# Altium project _X-Link-v11.PrjPCB
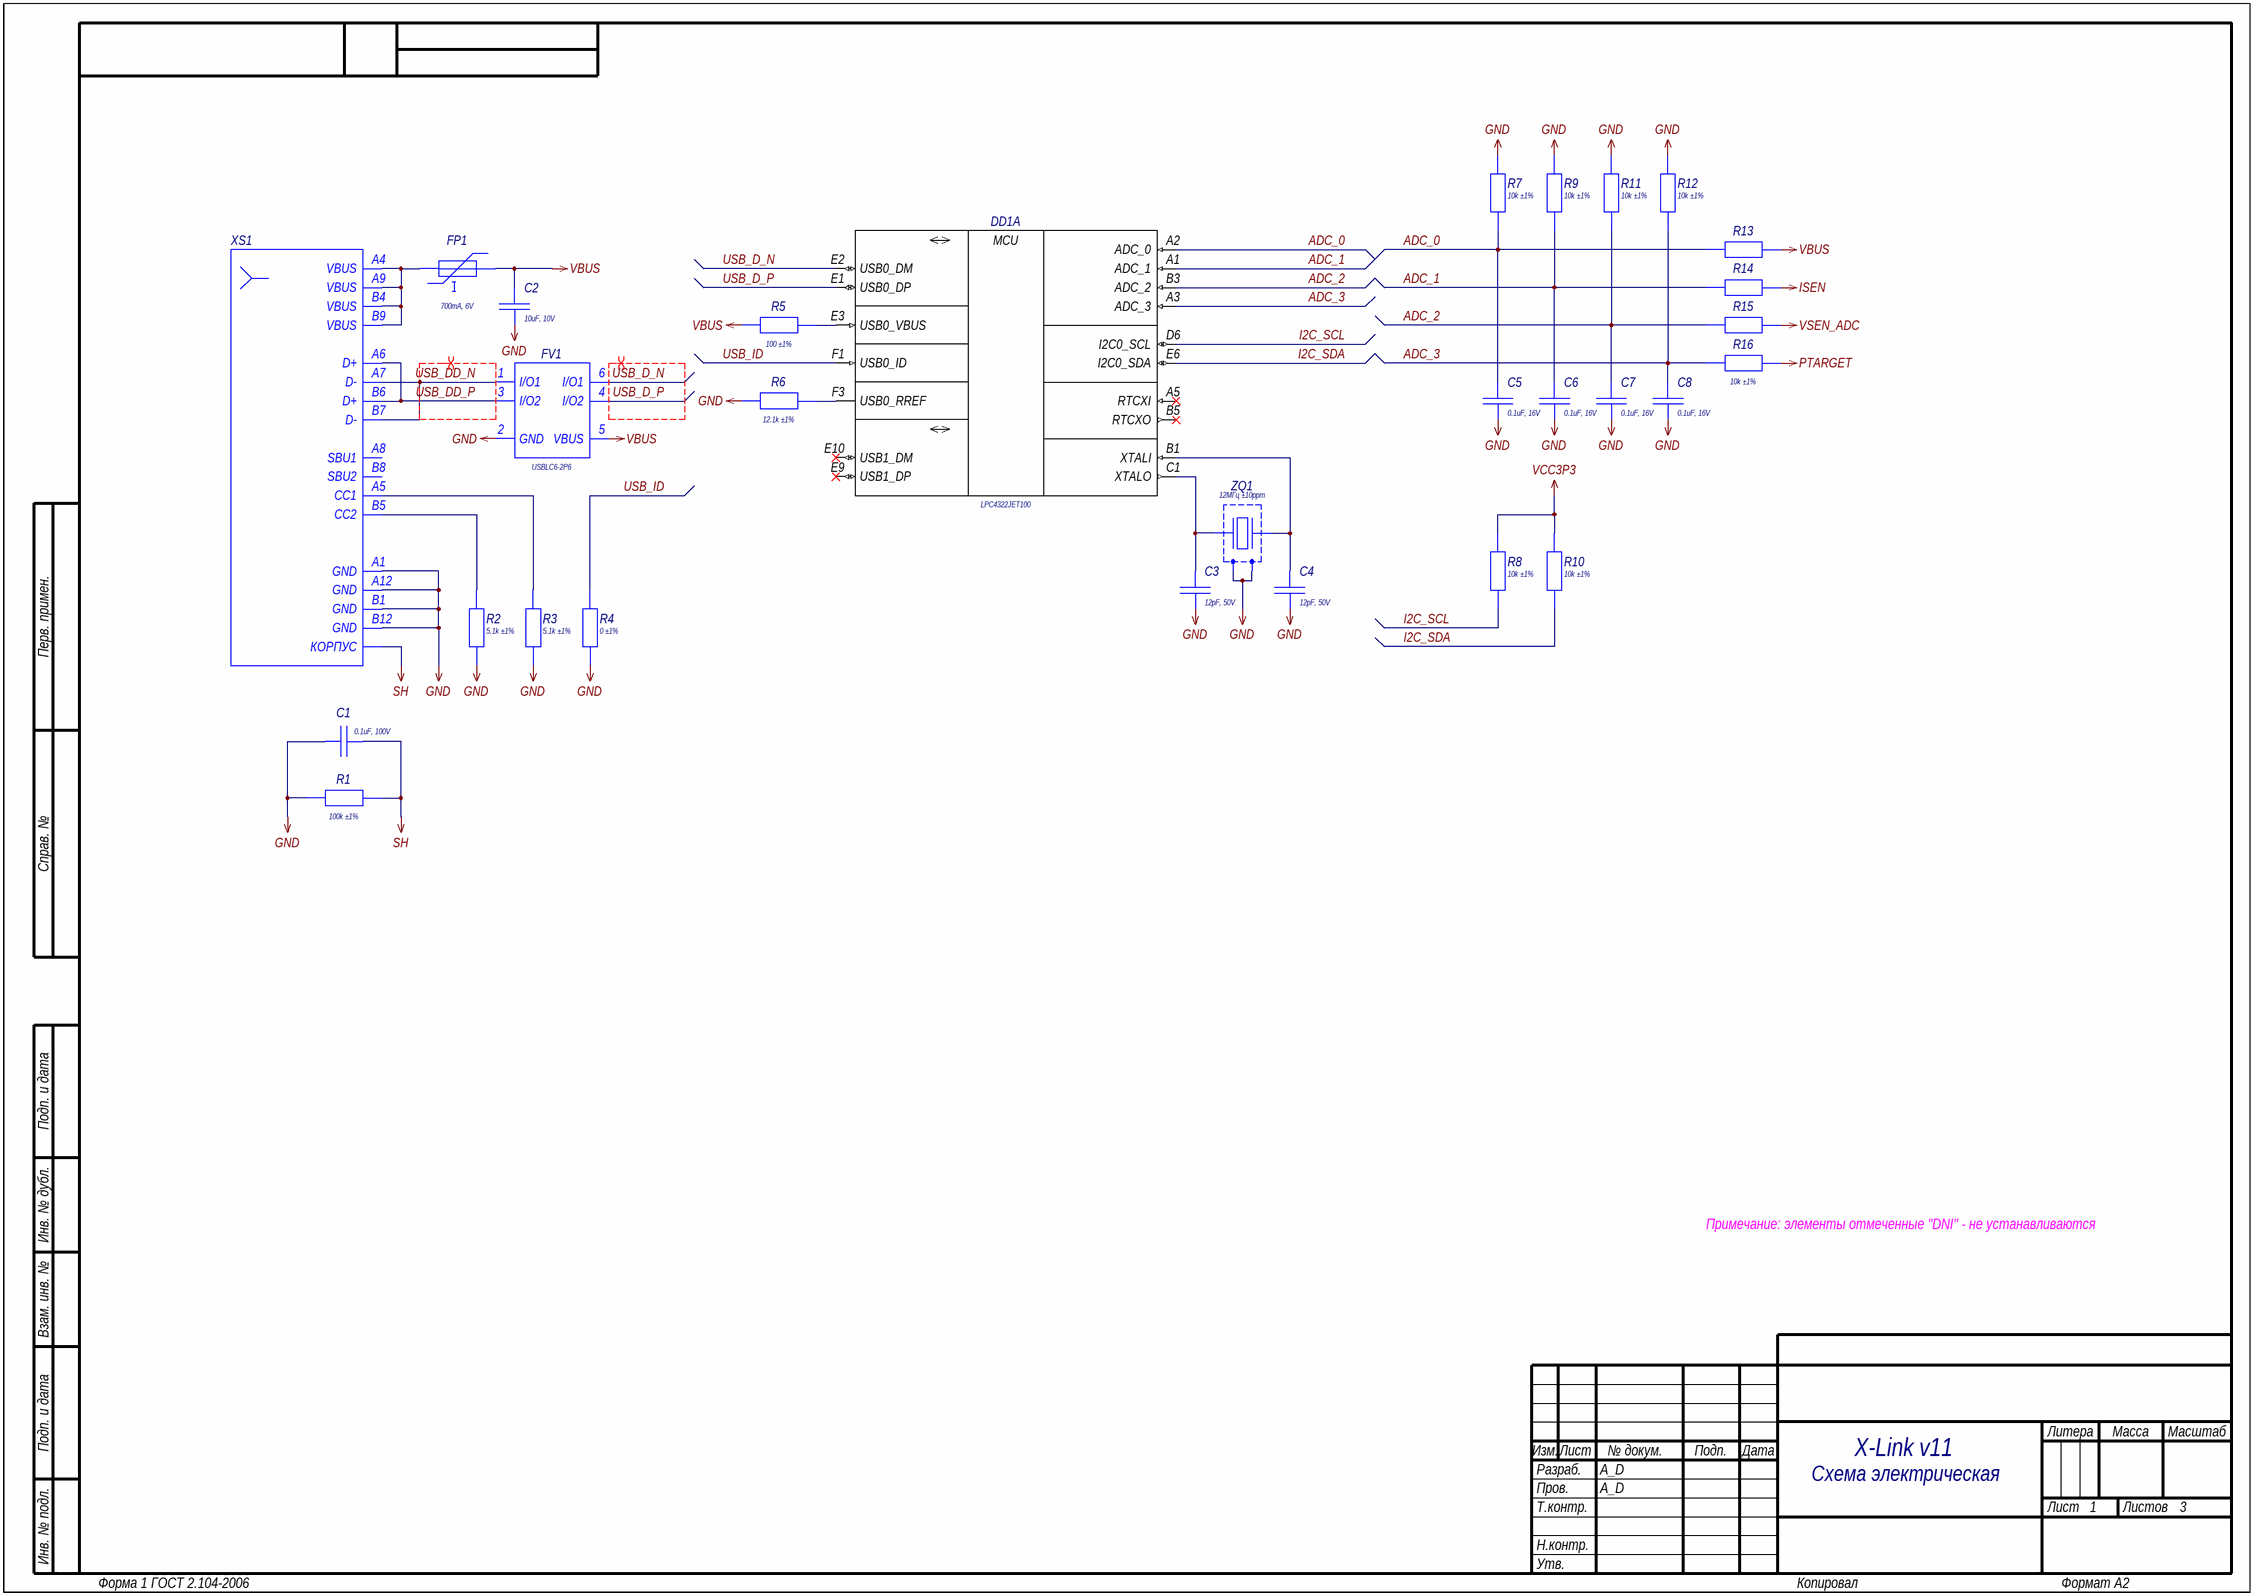
[diagram p0: 01_USB.SchDoc]
PCB_Week: 2347; GlobalProjectRevision: 1.1; GlobalProjectNumber: X-Link v11; GlobalProjectName: X-Link v11
3 sheets, 138 parts. Net scope: global (net labels, ports and power ports of the same name join across sheets).
Board file: PCB.PcbDoc
Sheets:
  01_USB.SchDoc
  02_MCU_IO.SchDoc
  03_POWER.SchDoc

## Sheet 01_USB.SchDoc: =GlobalProjectName
size 594 x 420 mm; CheckedBy: A_D; Author: A_D; DocumentNumber: X-Link v11 Э3; Revision: 1.1; SheetNumber: 1; SheetTotal: 3; PageSetup: Record=PageOptions|CenterHorizontal=True|CenterVertical=True|PrintScale=0.70|XCorrection=1.00|YCorrection=1.00|PrintKind=2|BorderSize=5000000|LeftOffset=9000|BottomOffset=10100|Orientation=2|PaperLength=11176|PaperWidth=8636|Scale=100|PaperSource=259|PrintQuality=-3|MediaType=1|DitherType=10|PrintScaleMode=1|PaperKind=A3|PaperIndex=8; FirstApplication: X-Link v11; DocumentName: X-Link v11

### Parts
C1  Schematic Value: 0.1uF, 100V  [C0603_160X080H080_H]  (hidden comment: Capacitor)
C2  Schematic Value: 10uF, 10V  [C0603_160X080H080_H]  (hidden comment: Capacitor)
C3  Schematic Value: 12pF, 50V  [C0402_100X050H050_H]  (hidden comment: Capacitor)
C4  Schematic Value: 12pF, 50V  [C0402_100X050H050_H]  (hidden comment: Capacitor)
C5  Schematic Value: 0.1uF, 16V  [C0402_100X050H050_H]  (hidden comment: Capacitor)
C6  Schematic Value: 0.1uF, 16V  [C0402_100X050H050_H]  (hidden comment: Capacitor)
C7  Schematic Value: 0.1uF, 16V  [C0402_100X050H050_H]  (hidden comment: Capacitor)
C8  Schematic Value: 0.1uF, 16V  [C0402_100X050H050_H]  (hidden comment: Capacitor)
DD1  Schematic Value: LPC4322JET100  [TFBGA-100_080P900X900X120_N]  (hidden comment: LPC43xxJET100-Series)  (part A of 3)
FP1  Schematic Value: 700mA, 6V  [F0402_115X065H060_H]  (hidden comment: Fuse_PTC)
FV1  Schematic Value: USBLC6-2P6  [SOT-666_050P160X120X060_N]  (hidden comment: USBLC6-2x6)
R1  Schematic Value: 100k ±1%  [R0402_100X050H035_H]  (hidden comment: Resistor)
R2  Schematic Value: 5.1k ±1%  [R0402_100X050H035_H]  (hidden comment: Resistor)
R3  Schematic Value: 5.1k ±1%  [R0402_100X050H035_H]  (hidden comment: Resistor)
R4  Schematic Value: 0 ±1%  [R0402_100X050H035_H]  (hidden comment: Resistor)
R5  Schematic Value: 100 ±1%  [R0402_100X050H035_H]  (hidden comment: Resistor)
R6  Schematic Value: 12.1k ±1%  [R0402_100X050H035_H]  (hidden comment: Resistor)
R7  Schematic Value: 10k ±1%  [R0402_100X050H035_H]  (hidden comment: Resistor)
R8  Schematic Value: 10k ±1%  [R0402_100X050H035_H]  (hidden comment: Resistor)
R9  Schematic Value: 10k ±1%  [R0402_100X050H035_H]  (hidden comment: Resistor)
R10  Schematic Value: 10k ±1%  [R0402_100X050H035_H]  (hidden comment: Resistor)
R11  Schematic Value: 10k ±1%  [R0402_100X050H035_H]  (hidden comment: Resistor)
R12  Schematic Value: 10k ±1%  [R0402_100X050H035_H]  (hidden comment: Resistor)
R13  Resistor  [R0402_100X050H035_H]  (value not drawn)
R14  Resistor  [R0402_100X050H035_H]  (value not drawn)
R15  Resistor  [R0402_100X050H035_H]  (value not drawn)
R16  Schematic Value: 10k ±1%  [R0402_100X050H035_H]  (hidden comment: Resistor)
XS1  Text  [U262-161N-4BVC11]  (value not drawn)
ZQ1  Schematic Value: 12МГц ±10ppm  [SMD 3.2x2.5mm]  (hidden comment: Crystal-1_3p_S)

### Nets
GND: C1.2 C2.1 C3.1 C4.1 C5.1 C6.1 C7.1 C8.1 FV1.2(GND) R1.2 R2.1 R3.1 R4.1 R6.1 R7.1 R9.1 R11.1 R12.1 XS1.A1(GND) XS1.A12(GND) XS1.B1(GND) XS1.B12(GND) ZQ1.2 ZQ1.4
ISEN: R14.1
PTARGET: R16.1
SH: C1.1 R1.1 XS1.SH(КОРПУС)
VBUS: C2.2 FP1.2 FV1.5(VBUS) R5.1 R13.1
VCC3P3: R8.1 R10.1
VSEN_ADC: R15.1
ADC_0: C5.2 DD1.A2(ADC_0) R7.2 R13.2
ADC_1: C6.2 DD1.A1(ADC_1) R9.2 R14.2
ADC_2: C7.2 DD1.B3(ADC_2) R11.2 R15.2
ADC_3: C8.2 DD1.A3(ADC_3) R12.2 R16.2
I2C_SCL: DD1.D6(I2C0_SCL) R8.2
I2C_SDA: DD1.E6(I2C0_SDA) R10.2
USB_D_N: DD1.E2(USB0_DM) FV1.6(I/O1)
USB_D_P: DD1.E1(USB0_DP) FV1.4(I/O2)
USB_DD_N: FV1.1(I/O1) XS1.A7(D-) XS1.B7(D-)
USB_DD_P: FV1.3(I/O2) XS1.A6(D+) XS1.B6(D+)
USB_ID: DD1.F1(USB0_ID) R4.2
NetC3_2: C3.2 DD1.C1(XTALO) ZQ1.1
NetC4_2: C4.2 DD1.B1(XTALI) ZQ1.3
NetDD1_E3: DD1.E3(USB0_VBUS) R5.2
NetDD1_F3: DD1.F3(USB0_RREF) R6.2
NetFP1_1: FP1.1 XS1.A4(VBUS) XS1.A9(VBUS) XS1.B4(VBUS) XS1.B9(VBUS)
NetR2_2: R2.2 XS1.B5(CC2)
NetR3_2: R3.2 XS1.A5(CC1)

Not connected (* = marked no-connect by the designer): DD1 A5(RTCXI)* B5(RTCXO)* E9(USB1_DP)* E10(USB1_DM)*; XS1 A8(SBU1) B8(SBU2)

### Layout directives
differential pair: USB_D_N, USB_D_P, USB_DD_N, USB_DD_P

### Notes on the sheet
- Примечание: элементы отмеченные "DNI" - не устанавливаются
- Схема электрическая
  принципиальная
- Перв. примен.
- Справ. №
- Подп. и дата
- Инв. № дубл.
- Взам. инв. №
- Разраб.
- Изм.
- Лист
- № докум.
- Подп.
- Дата
- Литера
- Масса
- Масштаб
- Пров.
- Т.контр.
- Листов
- Инв. № подл.
- Н.контр.
- Утв.
- Форма 1 ГОСТ 2.104-2006
- Копировал
- Формат А2
- (in symbol LPC4322JET100, part A) MCU

### Library data of the parts
C1 = GRM188R72A104KA35D: Manufacturer: Murata; ID: 232; Value: 0.1uF; Voltage: 100V; Tolerance: ±10%; Dielectric Type: X7R; Functional Analog: GRM188R72A104KA35J; AEC Standard: General; Part Number: GRM188R72A104KA35D; Footprint: 0603; LCSC Part: C113803; Temperature Min: -55°С; Temperature Max: +125°С; Part Type: Конденсатор; ClassName: DC
C2 = GRM188R61A106KE69D: Manufacturer: Murata; ID: 173; Value: 10uF; Voltage: 10V; Tolerance: ±10%; Dielectric Type: X5R; Functional Analog: GRM188R61A106KE69J; AEC Standard: General; Part Number: GRM188R61A106KE69D; Footprint: 0603; LCSC Part: C77044; Temperature Min: -55°С; Temperature Max: +85°С; Part Type: Конденсатор; ClassName: DC
C3 C4 = GRM1555C1H120JA01D: Manufacturer: Murata; ID: 159; Value: 12pF; Voltage: 50V; Tolerance: ±5%; Dielectric Type: NP0; Functional Analog: GJM1555C1H120GB01D, GRM1555C1H120JA01J, GRM1555C1H120JA01W; AEC Standard: General; Part Number: GRM1555C1H120JA01D; Footprint: 0402; LCSC Part: C76948; Temperature Min: -55°С; Temperature Max: +125°С; Part Type: Конденсатор
C5-C8 = GCM155R71C104KA55D: Manufacturer: Murata; ID: 163; Value: 0.1uF; Voltage: 16V; Tolerance: ±10%; Dielectric Type: X7R; Functional Analog: GRM155R71C104KA88D, GCM155R71C104KA55J, GCM155R71C104KA55W; AEC Standard: AEC-Q200; Part Number: GCM155R71C104KA55D; Footprint: 0402; LCSC Part: C85857; Temperature Min: -55°С; Temperature Max: +125°С; Part Type: Конденсатор
DD1 = LPC4322JET100: Manufacturer: NXP Semiconductors; ID: 45; Supply Operation: +2.4…3.6V; Prog Interface: JTAG, SWD, USB; Operation Frequency: 204MHz; ROM: 512K; RAM: 104K; IO Lines: 49; Part Number: LPC4322JET100; Value: LPC4322JET100; Temperature Min: -40°С; Temperature Max: +105°С
FP1 = 0402L035SLKR: Manufacturer: Littelfuse; ID: 17; Limit Voltage: 6V; Hold Current: 350mA; Resistance: 0.7ohm; Trip Current: 700mA; Current Rating Max: 50A; Part Number: 0402L035SLKR; Value: 0402L035SLKR; Temperature Min: -40°С; Temperature Max: +85°С; Part Type: Предохранитель; ClassName: DC
FV1 = USBLC6-2P6: Manufacturer: STMicroelectronics; ID: 30; Breakdown Voltage: 6V; Reverse Stand Off Voltage: 17V; Forward Voltage: 0.95V; Peak Forward Current: 5A; Junction Capacitance: 2.5pF; Directional: Bidirectional; Functional Analog: TPUSBLC6-2P6; Part Number: USBLC6-2P6; Value: USBLC6-2P6; LCSC Part: C15999; Temperature Min: -40°С; Temperature Max: +125°С
R1 = 0402WGF1003TCE: Manufacturer: Uniroyal Elec; ID: 661; Value: 100k; Limit Voltage: 50V; Tolerance: ±1%; Temperature Coefficient: 100ppm; Total Power Dissipation: 0.1W; Series Type: Thick-Film; Part Number: 0402WGF1003TCE; Footprint: 0402; Temperature Min: -55°С; Temperature Max: +155°С; Part Type: Резистор; LCSC Part: C25741; ClassName: DC
R2 R3 = 0402WGF5101TCE: Manufacturer: Uniroyal Elec; ID: 667; Value: 5.1k; Limit Voltage: 50V; Tolerance: ±1%; Temperature Coefficient: 100ppm; Total Power Dissipation: 0.1W; Series Type: Thick-Film; Part Number: 0402WGF5101TCE; Footprint: 0402; Temperature Min: -55°С; Temperature Max: +155°С; Part Type: Резистор; LCSC Part: C25905
R4 = 0402WGF0000TCE: Manufacturer: Uniroyal Elec; ID: 666; Value: 0; Limit Voltage: 50V; Tolerance: ±1%; Temperature Coefficient: 800ppm; Total Power Dissipation: 0.1W; Series Type: Thick-Film; Part Number: 0402WGF0000TCE; Footprint: 0402; Temperature Min: -55°С; Temperature Max: +155°С; Part Type: Резистор; LCSC Part: C17168
R5 = RC0402FR-07100RL: Manufacturer: Yageo; ID: 457; Value: 100; Limit Voltage: 50V; Tolerance: ±1%; Temperature Coefficient: 100ppm; Total Power Dissipation: 0.1W; Series Type: Thick-Film; Part Number: RC0402FR-07100RL; Footprint: 0402; Temperature Min: -55°С; Temperature Max: +155°С; Part Type: Резистор
R6 = RC0402FR-0712K1L: Manufacturer: Yageo; ID: 484; Value: 12.1k; Limit Voltage: 50V; Tolerance: ±1%; Temperature Coefficient: 100ppm; Total Power Dissipation: 0.1W; Series Type: Thick-Film; Part Number: RC0402FR-0712K1L; Footprint: 0402; Temperature Min: -55°С; Temperature Max: +155°С; Part Type: Резистор
R7-R12 R16 = 0402WGF1002TCE: Manufacturer: Uniroyal Elec; ID: 665; Value: 10k; Limit Voltage: 50V; Tolerance: ±1%; Temperature Coefficient: 100ppm; Total Power Dissipation: 0.1W; Series Type: Thick-Film; Part Number: 0402WGF1002TCE; Footprint: 0402; Temperature Min: -55°С; Temperature Max: +155°С; Part Type: Резистор; LCSC Part: C25744
R13-R15 = 0402WGF1002TCE: Manufacturer: Uniroyal Elec; ID: 665; Value: 10k; Limit Voltage: 50V; Tolerance: ±1%; Temperature Coefficient: 100ppm; Total Power Dissipation: 0.1W; Series Type: Thick-Film; Schematic Value: 10k ±1%; Part Number: 0402WGF1002TCE; Footprint: 0402; Temperature Min: -55°С; Temperature Max: +155°С; Part Type: Резистор; LCSC Part: C25744
XS1 = U262-161N-4BVC11: Manufacturer: XKB Enterprise; ID: 41; Limit Voltage: 30V; Limit Current: 3A; Connector Type: Female; Interface: USB 3.1 Type C; Max Data Rate: 5 Gbps; Part Number: U262-161N-4BVC11; Value: U262-161N-4BVC11; Pins: 16; Mount Type: Surface; LCSC Part: C319148; Temperature Min: -40°С; Temperature Max: +85°С; Schematic Value: U262-161N-4BVC11; Part Type: Розетка; ClassName: DC
ZQ1 = X322512MOB4SI: Manufacturer: Yangxing Tech; ID: 44; Output Frequency: 12МГц; Shunt Capacitance: 7pF; Load Capacitance: 12pF; Temperature Coefficient: ±10ppm; Part Number: X322512MOB4SI; Value: X322512MOB4SI; LCSC Part: C70565; Temperature Min: -40°С; Temperature Max: +85°С; Part Type: Кварцевый резонатор

## Sheet 02_MCU_IO.SchDoc: =GlobalProjectName
size 594 x 420 mm; CheckedBy: A_D; Author: A_D; DocumentNumber: X-Link v11 Э3; Revision: 1.1; SheetNumber: 2; SheetTotal: 3; PageSetup: Record=PageOptions|CenterHorizontal=True|CenterVertical=True|PrintScale=0.70|XCorrection=1.00|YCorrection=1.00|PrintKind=2|BorderSize=5000000|LeftOffset=9000|BottomOffset=10100|Orientation=2|PaperLength=11176|PaperWidth=8636|Scale=100|PaperSource=259|PrintQuality=-3|MediaType=1|DitherType=10|PrintScaleMode=1|PaperKind=A3|PaperIndex=8; FirstApplication: X-Link v11; DocumentName: X-Link v11
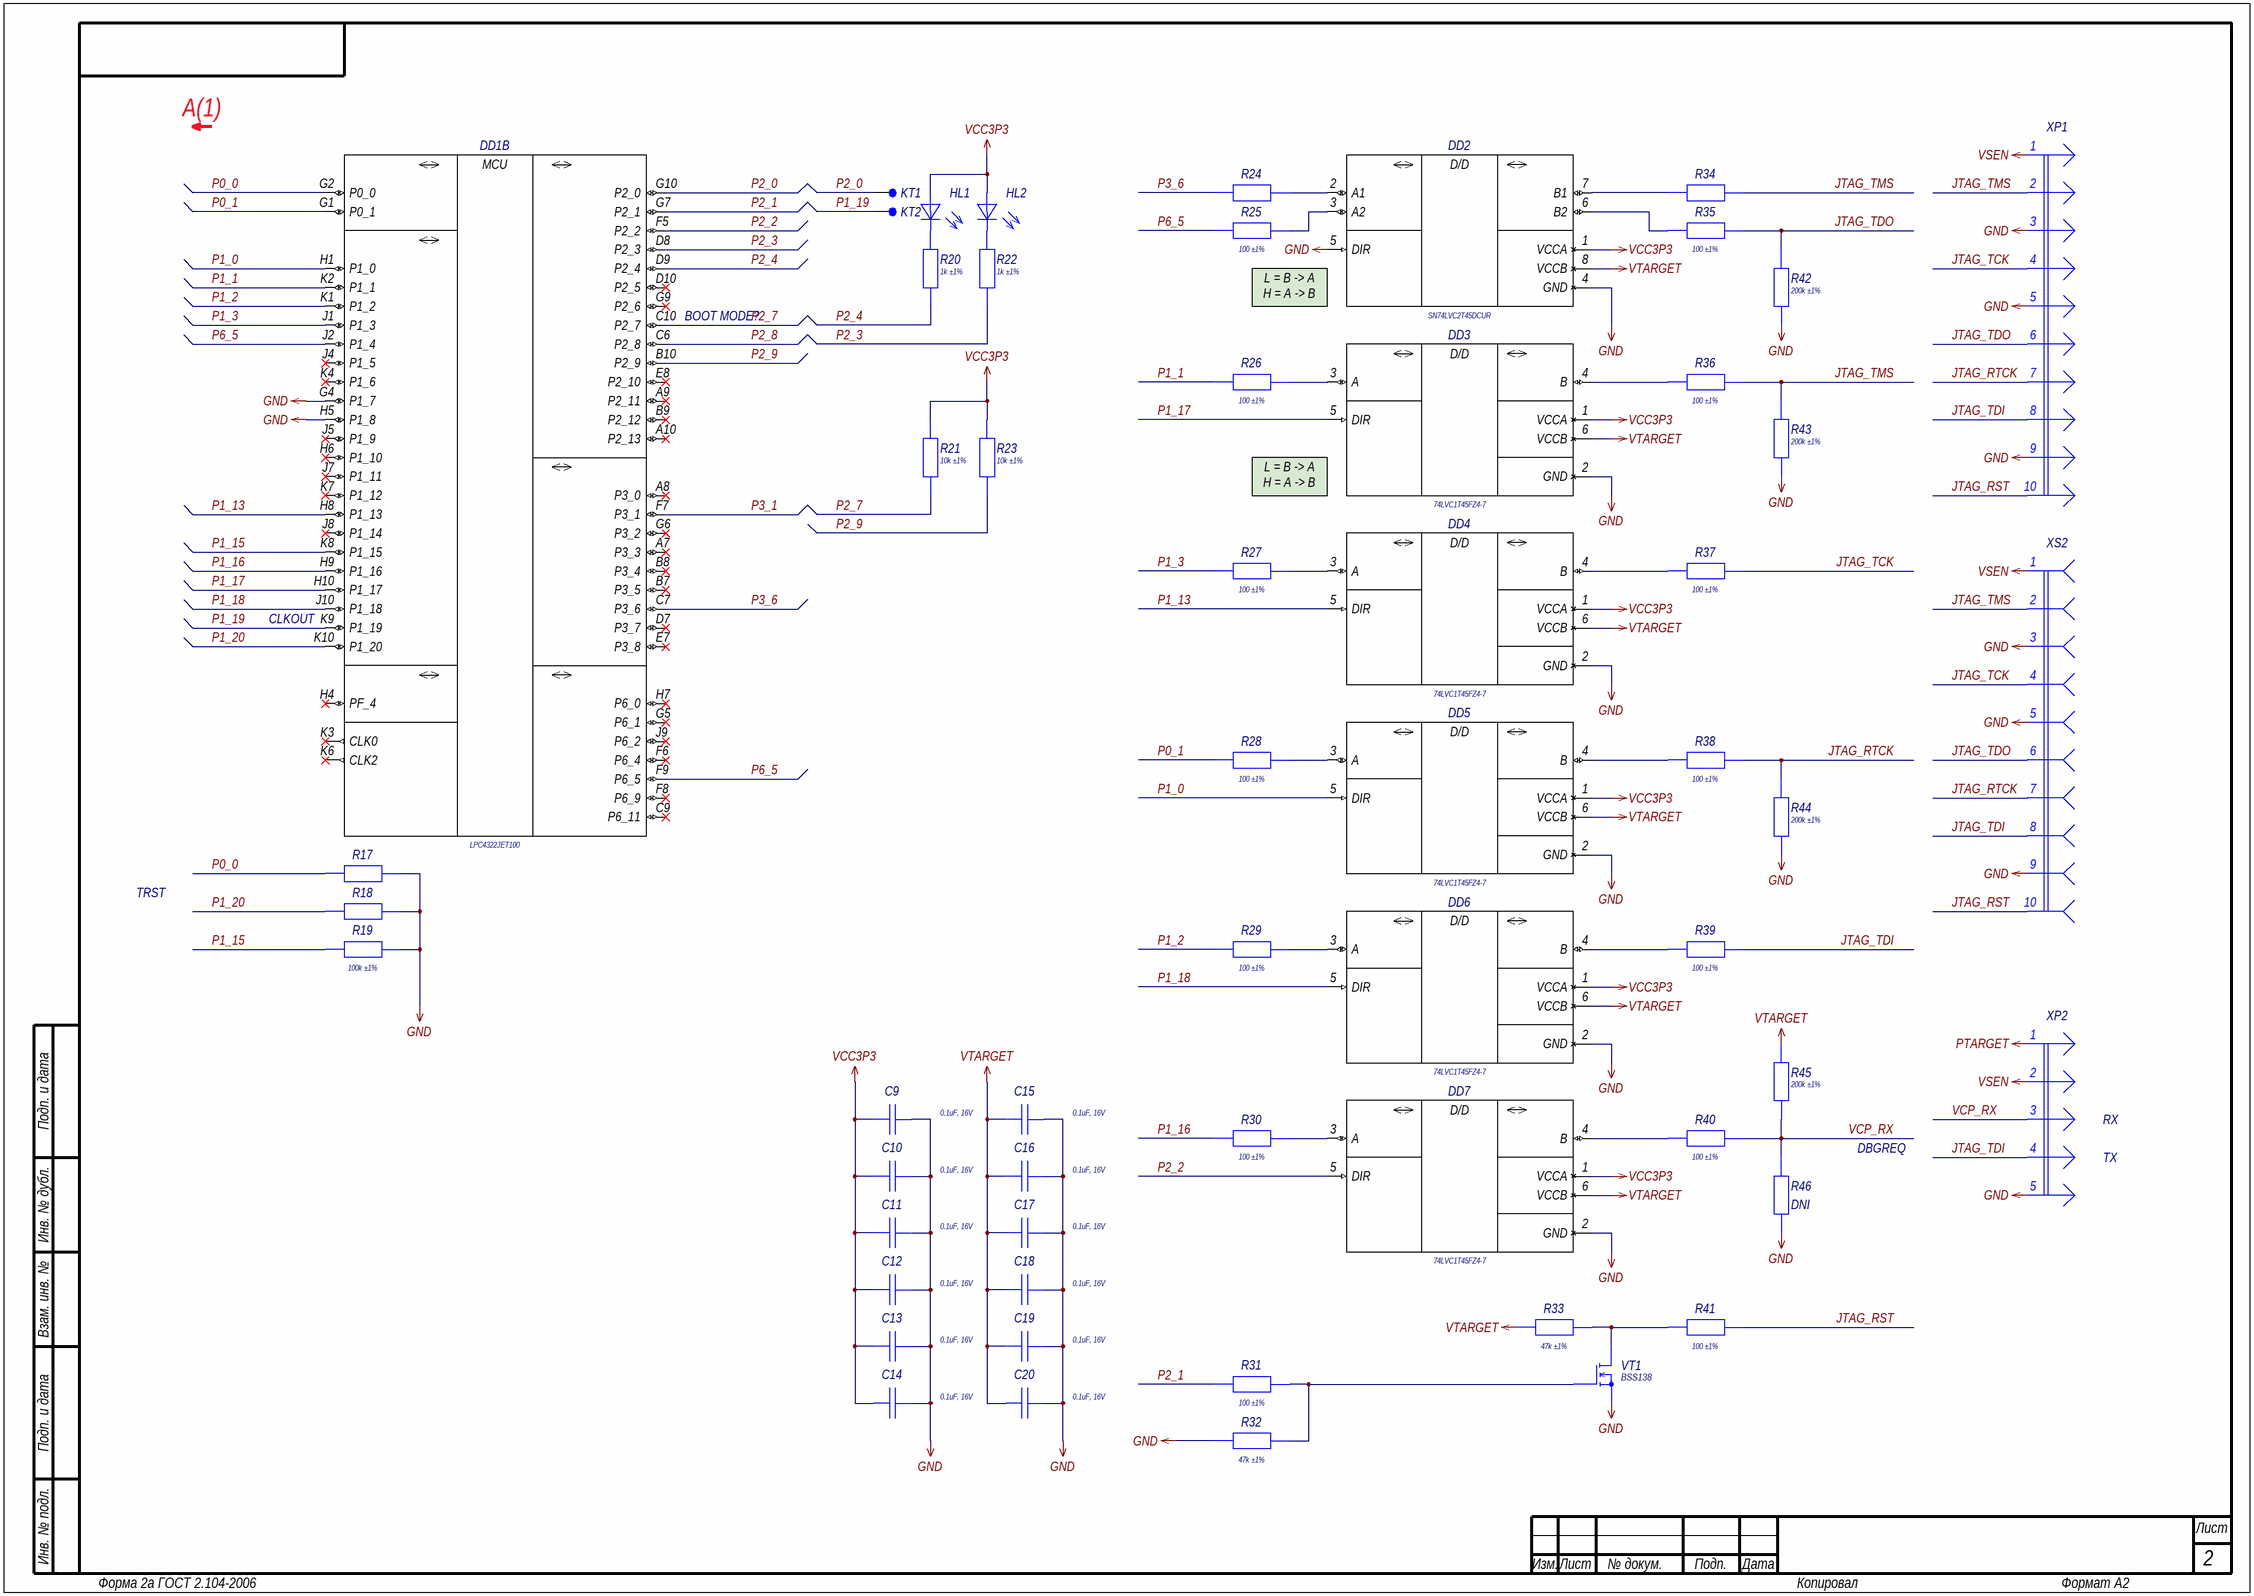
[diagram p1: 02_MCU_IO.SchDoc]

### Parts
C9  Schematic Value: 0.1uF, 16V  [C0402_100X050H050_H]  (hidden comment: Capacitor)
C10  Schematic Value: 0.1uF, 16V  [C0402_100X050H050_H]  (hidden comment: Capacitor)
C11  Schematic Value: 0.1uF, 16V  [C0402_100X050H050_H]  (hidden comment: Capacitor)
C12  Schematic Value: 0.1uF, 16V  [C0402_100X050H050_H]  (hidden comment: Capacitor)
C13  Schematic Value: 0.1uF, 16V  [C0402_100X050H050_H]  (hidden comment: Capacitor)
C14  Schematic Value: 0.1uF, 16V  [C0402_100X050H050_H]  (hidden comment: Capacitor)
C15  Schematic Value: 0.1uF, 16V  [C0402_100X050H050_H]  (hidden comment: Capacitor)
C16  Schematic Value: 0.1uF, 16V  [C0402_100X050H050_H]  (hidden comment: Capacitor)
C17  Schematic Value: 0.1uF, 16V  [C0402_100X050H050_H]  (hidden comment: Capacitor)
C18  Schematic Value: 0.1uF, 16V  [C0402_100X050H050_H]  (hidden comment: Capacitor)
C19  Schematic Value: 0.1uF, 16V  [C0402_100X050H050_H]  (hidden comment: Capacitor)
C20  Schematic Value: 0.1uF, 16V  [C0402_100X050H050_H]  (hidden comment: Capacitor)
DD1  Schematic Value: LPC4322JET100  [TFBGA-100_080P900X900X120_N]  (hidden comment: LPC43xxJET100-Series)  (part B of 3)
DD2  Schematic Value: SN74LVC2T45DCUR  [VSSOP-8_050P200X230X090_N]  (hidden comment: SN74LVC2T45DCx-Series)
DD3  Schematic Value: 74LVC1T45FZ4-7  [X2-DFN-6_050P140X100X040_N]  (hidden comment: 74LVC1T45x-Series)
DD4  Schematic Value: 74LVC1T45FZ4-7  [X2-DFN-6_050P140X100X040_N]  (hidden comment: 74LVC1T45x-Series)
DD5  Schematic Value: 74LVC1T45FZ4-7  [X2-DFN-6_050P140X100X040_N]  (hidden comment: 74LVC1T45x-Series)
DD6  Schematic Value: 74LVC1T45FZ4-7  [X2-DFN-6_050P140X100X040_N]  (hidden comment: 74LVC1T45x-Series)
DD7  Schematic Value: 74LVC1T45FZ4-7  [X2-DFN-6_050P140X100X040_N]  (hidden comment: 74LVC1T45x-Series)
HL1  Text  [LD0603_L]  (value not drawn)
HL2  Text  [LD0603_L]  (value not drawn)
KT1  Text  [TP-SMT-C-0.5mm]  (value not drawn)  (no BOM)
KT2  Text  [TP-SMT-C-0.5mm]  (value not drawn)  (no BOM)
R17  Resistor  [R0402_100X050H035_H]  (value not drawn)
R18  Resistor  [R0402_100X050H035_H]  (value not drawn)
R19  Schematic Value: 100k ±1%  [R0402_100X050H035_H]  (hidden comment: Resistor)
R20  Schematic Value: 1k ±1%  [R0402_100X050H035_H]  (hidden comment: Resistor)
R21  Schematic Value: 10k ±1%  [R0402_100X050H035_H]  (hidden comment: Resistor)
R22  Schematic Value: 1k ±1%  [R0402_100X050H035_H]  (hidden comment: Resistor)
R23  Schematic Value: 10k ±1%  [R0402_100X050H035_H]  (hidden comment: Resistor)
R24  Resistor  [R0402_100X050H035_H]  (value not drawn)
R25  Schematic Value: 100 ±1%  [R0402_100X050H035_H]  (hidden comment: Resistor)
R26  Schematic Value: 100 ±1%  [R0402_100X050H035_H]  (hidden comment: Resistor)
R27  Schematic Value: 100 ±1%  [R0402_100X050H035_H]  (hidden comment: Resistor)
R28  Schematic Value: 100 ±1%  [R0402_100X050H035_H]  (hidden comment: Resistor)
R29  Schematic Value: 100 ±1%  [R0402_100X050H035_H]  (hidden comment: Resistor)
R30  Schematic Value: 100 ±1%  [R0402_100X050H035_H]  (hidden comment: Resistor)
R31  Schematic Value: 100 ±1%  [R0402_100X050H035_H]  (hidden comment: Resistor)
R32  Schematic Value: 47k ±1%  [R0402_100X050H035_H]  (hidden comment: Resistor)
R33  Schematic Value: 47k ±1%  [R0402_100X050H035_H]  (hidden comment: Resistor)
R34  Resistor  [R0402_100X050H035_H]  (value not drawn)
R35  Schematic Value: 100 ±1%  [R0402_100X050H035_H]  (hidden comment: Resistor)
R36  Schematic Value: 100 ±1%  [R0402_100X050H035_H]  (hidden comment: Resistor)
R37  Schematic Value: 100 ±1%  [R0402_100X050H035_H]  (hidden comment: Resistor)
R38  Schematic Value: 100 ±1%  [R0402_100X050H035_H]  (hidden comment: Resistor)
R39  Schematic Value: 100 ±1%  [R0402_100X050H035_H]  (hidden comment: Resistor)
R40  Schematic Value: 100 ±1%  [R0402_100X050H035_H]  (hidden comment: Resistor)
R41  Schematic Value: 100 ±1%  [R0402_100X050H035_H]  (hidden comment: Resistor)
R42  Schematic Value: 200k ±1%  [R0402_100X050H035_H]  (hidden comment: Resistor)
R43  Schematic Value: 200k ±1%  [R0402_100X050H035_H]  (hidden comment: Resistor)
R44  Schematic Value: 200k ±1%  [R0402_100X050H035_H]  (hidden comment: Resistor)
R45  Schematic Value: 200k ±1%  [R0402_100X050H035_H]  (hidden comment: Resistor)
R46  Resistor  [R0402_100X050H035_H]  (value not drawn)  (no BOM)
VT1  Schematic Value: BSS138  [SOT-23_190P290X160X145_N]  (hidden comment: MOSFET-N_32)
XP1  Text  [IDC-10MR]  (value not drawn)
XP2  Text  [PLS-5RR]  (value not drawn)
XS2  Text  [XF2M-1015-1A]  (value not drawn)

### Nets
GND: C9.1 C10.1 C11.1 C12.1 C13.1 C14.1 C15.1 C16.1 C17.1 C18.1 C19.1 C20.1 DD1.G4(P1_7) DD1.H5(P1_8) DD2.4(GND) DD2.5(DIR) DD3.2(GND) DD4.2(GND) DD5.2(GND) DD6.2(GND) DD7.2(GND) R17.2 R18.2 R19.2 R32.2 R42.1 R43.1 R44.1 R46.1 VT1.2(S) XP1.3 XP1.5 XP1.9 XP2.5 XS2.3 XS2.5 XS2.9
PTARGET: XP2.1
VCC3P3: C9.2 C10.2 C11.2 C12.2 C13.2 C14.2 DD2.1(VCCA) DD3.1(VCCA) DD4.1(VCCA) DD5.1(VCCA) DD6.1(VCCA) DD7.1(VCCA) HL1.1 HL2.1 R21.1 R23.1
VSEN: XP1.1 XP2.2 XS2.1
VTARGET: C15.2 C16.2 C17.2 C18.2 C19.2 C20.2 DD2.8(VCCB) DD3.6(VCCB) DD4.6(VCCB) DD5.6(VCCB) DD6.6(VCCB) DD7.6(VCCB) R33.2 R45.2
JTAG_RST: R41.2 XP1.10 XS2.10
JTAG_RTCK: R38.2 R44.2 XP1.7 XS2.7
JTAG_TCK: R37.2 XP1.4 XS2.4
JTAG_TDI: R39.2 XP1.8 XP2.4 XS2.8
JTAG_TDO: R35.2 R42.2 XP1.6 XS2.6
JTAG_TMS: R34.2 R36.2 R43.2 XP1.2 XS2.2
P0_0: DD1.G2(P0_0) R17.1
P0_1: DD1.G1(P0_1) R28.1
P1_0: DD1.H1(P1_0) DD5.5(DIR)
P1_1: DD1.K2(P1_1) R26.1
P1_2: DD1.K1(P1_2) R29.1
P1_3: DD1.J1(P1_3) R27.1
P1_13: DD1.H8(P1_13) DD4.5(DIR)
P1_15: DD1.K8(P1_15) R19.1
P1_16: DD1.H9(P1_16) R30.1
P1_17: DD1.H10(P1_17) DD3.5(DIR)
P1_18: DD1.J10(P1_18) DD6.5(DIR)
P1_19: DD1.K9(P1_19) KT2.1
P1_20: DD1.K10(P1_20) R18.1
P2_0: DD1.G10(P2_0) KT1.1
P2_1: DD1.G7(P2_1) R31.1
P2_2: DD1.F5(P2_2) DD7.5(DIR)
P2_3: DD1.D8(P2_3) R22.1
P2_4: DD1.D9(P2_4) R20.1
P2_7: DD1.C10(P2_7) R21.2
P2_8: DD1.C6(P2_8)
P2_9: DD1.B10(P2_9) R23.2
P3_1: DD1.F7(P3_1)
P3_6: DD1.C7(P3_6) R24.1
P6_5: DD1.F9(P6_5) DD1.J2(P1_4) R25.1
VCP_RX: R40.2 R45.1 R46.2 XP2.3
NetDD2_2: DD2.2(A1) R24.2
NetDD2_3: DD2.3(A2) R25.2
NetDD2_6: DD2.6(B2) R35.1
NetDD2_7: DD2.7(B1) R34.1
NetDD3_3: DD3.3(A) R26.2
NetDD3_4: DD3.4(B) R36.1
NetDD4_3: DD4.3(A) R27.2
NetDD4_4: DD4.4(B) R37.1
NetDD5_3: DD5.3(A) R28.2
NetDD5_4: DD5.4(B) R38.1
NetDD6_3: DD6.3(A) R29.2
NetDD6_4: DD6.4(B) R39.1
NetDD7_3: DD7.3(A) R30.2
NetDD7_4: DD7.4(B) R40.1
NetHL1_2: HL1.2 R20.2
NetHL2_2: HL2.2 R22.2
NetR31_2: R31.2 R32.1 VT1.1(G)
NetR33_1: R33.1 R41.1 VT1.3(D)

Not connected (* = marked no-connect by the designer): DD1 A7(P3_3)* A8(P3_0)* A9(P2_11)* A10(P2_13)* B7(P3_5)* B8(P3_4)* B9(P2_12)* C9(P6_11)* D7(P3_7)* D10(P2_5)* E7(P3_8)* E8(P2_10)* F6(P6_4)* F8(P6_9)* G5(P6_1)* G6(P3_2)* G9(P2_6)* H4(PF_4)* H6(P1_10)* H7(P6_0)* J4(P1_5)* J5(P1_9)* J7(P1_11)* J8(P1_14)* J9(P6_2)* K3(CLK0)* K4(P1_6)* K6(CLK2)* K7(P1_12)*

### Notes on the sheet
- А(1)
- (near DD2) L = B -> A
  H = A -> B
- (near DD1) BOOT MODE?
- (near DD3) L = B -> A
  H = A -> B
- (near DD1) CLKOUT
- TRST
- RX
- DBGREQ
- TX
- (near R46) DNI
- Подп. и дата
- Инв. № дубл.
- Взам. инв. №
- Инв. № подл.
- Изм.
- Лист
- № докум.
- Подп.
- Дата
- Форма 2а ГОСТ 2.104-2006
- Копировал
- Формат А2
- (in symbol 74LVC1T45FZ4-7) D/D
- (in symbol LPC4322JET100, part B) MCU
- (in symbol SN74LVC2T45DCUR) D/D

### Library data of the parts
C9-C20 = GCM155R71C104KA55D: as C5 on sheet 01_USB; Part Number: GCM155R71C104KA55D; Footprint: 0402; LCSC Part: C85857; Temperature Min: -55°С; Temperature Max: +125°С; Part Type: Конденсатор
DD1 = LPC4322JET100: as DD1 on sheet 01_USB; Part Number: LPC4322JET100; Value: LPC4322JET100; Temperature Min: -40°С; Temperature Max: +105°С
DD2 = SN74LVC2T45DCUR: Manufacturer: Texas Instruments; ID: 18; Supply 1 Operation: +1,65…5,5V; Supply Current: 10uA; Directional: Unidirection; Channels: 2; Max Data Rate: 420Mbps; Functional Analog: 74LVCH2T45DC,125; Part Number: SN74LVC2T45DCUR; Value: SN74LVC2T45DCUR; Supply 2 Operation: +1,65…5,5V; LCSC Part: C15741; Temperature Min: -40°С; Temperature Max: +85°С; Part Type: Микросхема
DD3-DD7 = 74LVC1T45FZ4-7: Manufacturer: Diodes Incorporated; ID: 13; Supply 1 Operation: +1.65…5.5V; Supply Current: 3uA; Directional: Bidirection; Channels: 1; Prop Delay: 15.1nS; Part Number: 74LVC1T45FZ4-7; Value: 74LVC1T45FZ4-7; Supply 2 Operation: +1.65…5.5V; LCSC Part: C150482; Temperature Min: -40°С; Temperature Max: +150°С; Part Type: Микросхема
HL1 = NCD0603R1: Manufacturer: Foshan NationStar Optoelectronics; Type: Индикатор единичный; ID: 42; Forward Voltage: 2.0V; Forward Current: 25mA; Power Dissipation: 65mW; Luminous Flux: 120; Color: Red; Leds: 1; Published: 03.12.2013; Publisher: Andrew Danich; Part Number: NCD0603R1; Value: NCD0603R1; Footprint: 0603; LCSC Part: C84263; Temperature Min: -30°С; Temperature Max: +85°С; Schematic Value: NCD0603R1
HL2 = NCD0603G1: Manufacturer: Foshan NationStar Optoelectronics; Type: Индикатор единичный; ID: 45; Forward Voltage: 3.0V; Forward Current: 20mA; Power Dissipation: 72mW; Luminous Flux: 650; Color: Green; Leds: 1; Published: 03.12.2013; Publisher: Andrew Danich; Part Number: NCD0603G1; Value: NCD0603G1; Footprint: 0603; LCSC Part: C84267; Temperature Min: -30°С; Temperature Max: +85°С; Schematic Value: NCD0603G1
KT1 KT2 = TestPoint-SMT: ID: 6; Application Type: On PCB Test Point; Published: 03.03.2015; Publisher: Andrew Danich; Part Number: TestPoint-SMT; Value: TestPoint-SMT; Schematic Value: TestPoint-SMT
R17 R18 = 0402WGF1003TCE: Manufacturer: Uniroyal Elec; ID: 661; Value: 100k; Limit Voltage: 50V; Tolerance: ±1%; Temperature Coefficient: 100ppm; Total Power Dissipation: 0.1W; Series Type: Thick-Film; Schematic Value: 100k ±1%; Part Number: 0402WGF1003TCE; Footprint: 0402; Temperature Min: -55°С; Temperature Max: +155°С; Part Type: Резистор; LCSC Part: C25741
R19 = 0402WGF1003TCE: as R1 on sheet 01_USB; Part Number: 0402WGF1003TCE; Footprint: 0402; Temperature Min: -55°С; Temperature Max: +155°С; Part Type: Резистор; LCSC Part: C25741
R20 R22 = 0402WGF1001TCE: Manufacturer: Uniroyal Elec; ID: 663; Value: 1k; Limit Voltage: 50V; Tolerance: ±1%; Temperature Coefficient: 100ppm; Total Power Dissipation: 0.1W; Series Type: Thick-Film; Part Number: 0402WGF1001TCE; Footprint: 0402; Temperature Min: -55°С; Temperature Max: +155°С; Part Type: Резистор; LCSC Part: C11702
R21 R23 = 0402WGF1002TCE: as R7 on sheet 01_USB; Part Number: 0402WGF1002TCE; Footprint: 0402; Temperature Min: -55°С; Temperature Max: +155°С; Part Type: Резистор; LCSC Part: C25744
R24 R34 = RC0402FR-07100RL: Manufacturer: Yageo; ID: 457; Value: 100; Limit Voltage: 50V; Tolerance: ±1%; Temperature Coefficient: 100ppm; Total Power Dissipation: 0.1W; Series Type: Thick-Film; Schematic Value: 100 ±1%; Part Number: RC0402FR-07100RL; Footprint: 0402; Temperature Min: -55°С; Temperature Max: +155°С; Part Type: Резистор
R25-R31 R35-R41 = RC0402FR-07100RL: as R5 on sheet 01_USB; Part Number: RC0402FR-07100RL; Footprint: 0402; Temperature Min: -55°С; Temperature Max: +155°С; Part Type: Резистор
R32 R33 = 0402WGF4702TCE: Manufacturer: Uniroyal Elec; ID: 668; Value: 47k; Limit Voltage: 50V; Tolerance: ±1%; Temperature Coefficient: 100ppm; Total Power Dissipation: 0.1W; Series Type: Thick-Film; Part Number: 0402WGF4702TCE; Footprint: 0402; Temperature Min: -55°С; Temperature Max: +155°С; Part Type: Резистор; LCSC Part: C25792
R42-R45 = 0402WGF2003TCE: Manufacturer: Uniroyal Elec; ID: 676; Value: 200k; Limit Voltage: 50V; Tolerance: ±1%; Temperature Coefficient: 100ppm; Total Power Dissipation: 0.1W; Series Type: Thick-Film; Part Number: 0402WGF2003TCE; Footprint: 0402; Temperature Min: -55°С; Temperature Max: +155°С; Part Type: Резистор; LCSC Part: C25764
R46 = 0402WGF2003TCE: Manufacturer: Uniroyal Elec; ID: 676; Value: 200k; Limit Voltage: 50V; Tolerance: ±1%; Temperature Coefficient: 100ppm; Total Power Dissipation: 0.1W; Series Type: Thick-Film; Schematic Value: 200k ±1%; Part Number: 0402WGF2003TCE; Footprint: 0402; Temperature Min: -55°С; Temperature Max: +155°С; Part Type: Резистор; LCSC Part: C25764
VT1 = BSS138: Type: Транзистор; ID: 58; Value: BSS138; D-S Voltage: 50V; Drain Current: 220mA; D-S On-Resistance: 6omh; Gate Capacitance: 27pF; Total Power Dissipation: 350mW; Gate Threshold Voltage: 1.5V; Published: 24.09.2010; Publisher: Andrew Danich; Part Number: BSS138; Temperature Min: -55°С; Temperature Max: +150°С; Part Type: Транзистор
XP1 = IDC-10MR: ID: 11; Limit Voltage: 500V; Limit Current: 1A; Connector Type: Male; Resistance: 20mohm; Pitch: 2.54mm; Functional Analog: DS1013-10RSIB, C3510-10SPGB00; Part Number: IDC-10MR; Value: IDC-10MR; Pins: 10; Schematic Value: IDC-10MR
XP2 = PLS-5R: Part Number: PLS-5R; ID: 32; Value: PLS-5R; Limit Voltage: 250V; Limit Current: 3A; Connector Type: Male; Resistance: 15momh; Surface Finish: Gold; Pitch: 2.54mm; Pins: 5; Schematic Value: PLS-5R
XS2 = XF2M-1015-1A: Manufacturer: Omron Electronics; ID: 7; Limit Voltage: 50V; Limit Current: 500mA; Connector Type: Female; Resistance: 0.05ohm; Pitch: 0.5mm; Functional Analog: AFC24-S10FIA-00; Part Number: XF2M-1015-1A; Value: XF2M-1015-1A; Pins: 10; Series: FPC; Temperature Min: -30°С; Temperature Max: +85°С; Schematic Value: XF2M-1015-1A

## Sheet 03_POWER.SchDoc: =GlobalProjectName
size 594 x 420 mm; CheckedBy: A_D; Author: A_D; DocumentNumber: X-Link v11 Э3; Revision: 1.1; SheetNumber: 3; SheetTotal: 3; PageSetup: Record=PageOptions|CenterHorizontal=True|CenterVertical=True|PrintScale=0.70|XCorrection=1.00|YCorrection=1.00|PrintKind=2|BorderSize=5000000|LeftOffset=9000|BottomOffset=10100|Orientation=2|PaperLength=11176|PaperWidth=8636|Scale=100|PaperSource=259|PrintQuality=-3|MediaType=1|DitherType=10|PrintScaleMode=1|PaperKind=A3|PaperIndex=8; FirstApplication: X-Link v11; DocumentName: X-Link v11
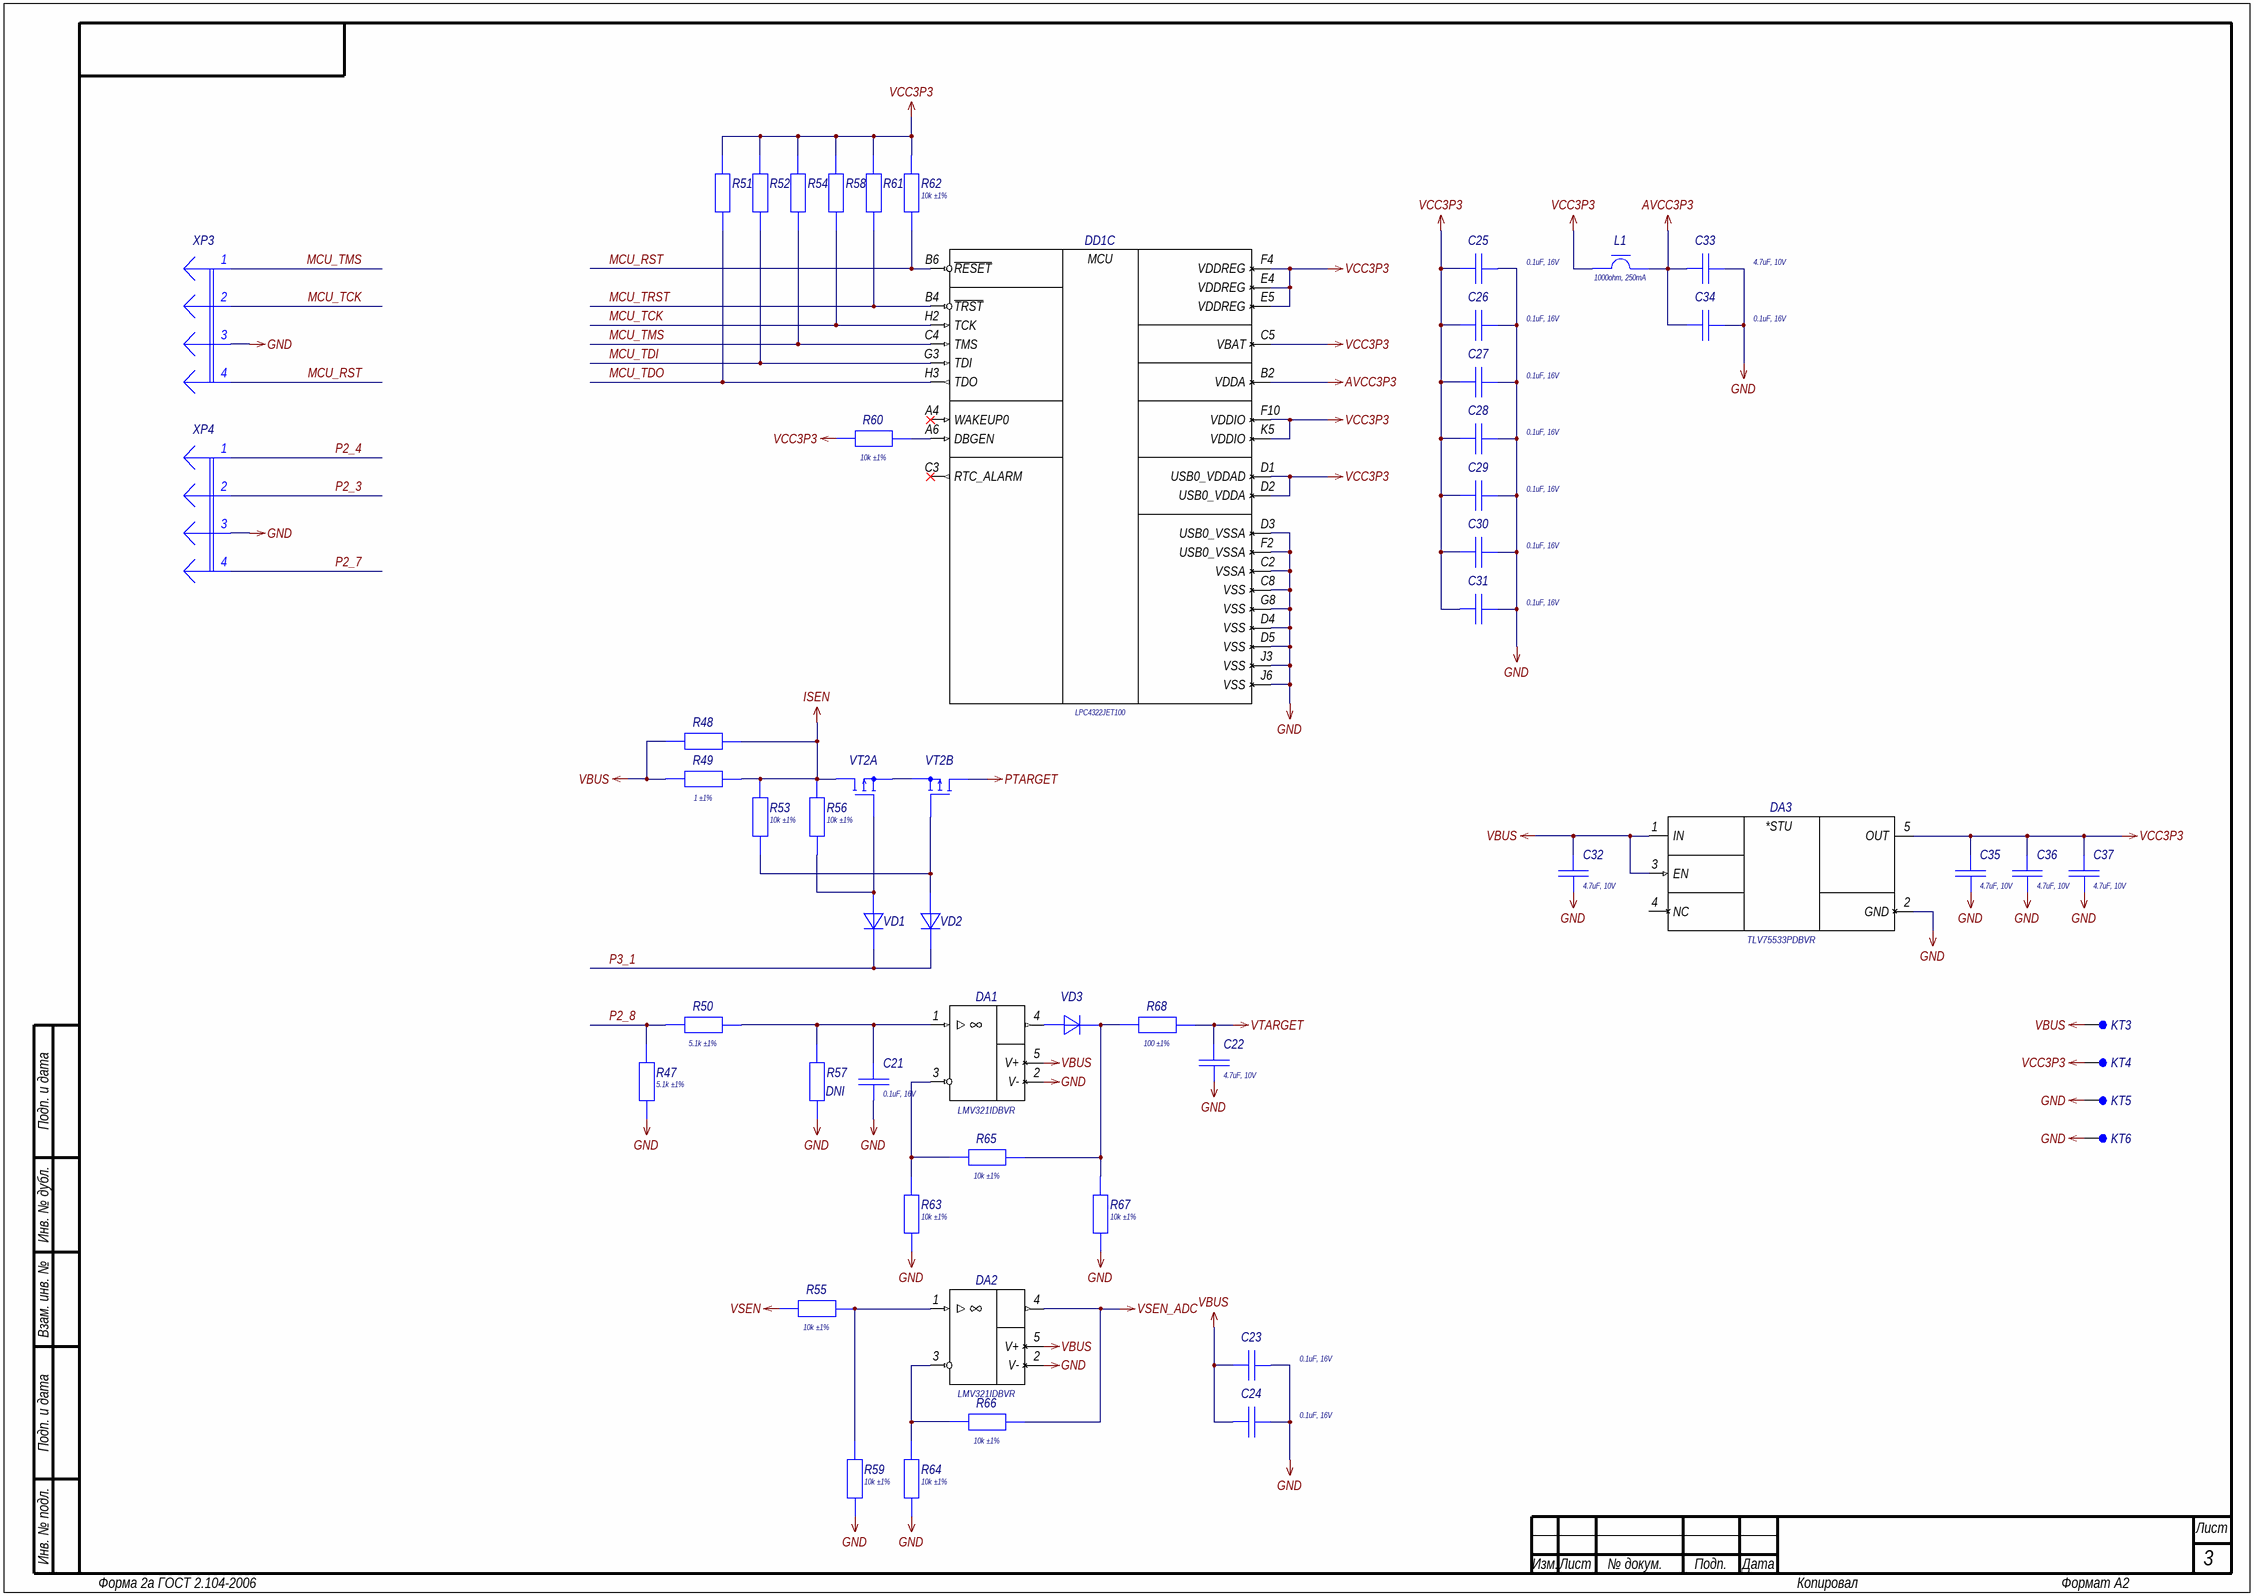
[diagram p2: 03_POWER.SchDoc]

### Parts
C21  Schematic Value: 0.1uF, 16V  [C0402_100X050H050_H]  (hidden comment: Capacitor)
C22  Schematic Value: 4.7uF, 10V  [C0402_100X050H050_H]  (hidden comment: Capacitor)
C23  Schematic Value: 0.1uF, 16V  [C0402_100X050H050_H]  (hidden comment: Capacitor)
C24  Schematic Value: 0.1uF, 16V  [C0402_100X050H050_H]  (hidden comment: Capacitor)
C25  Schematic Value: 0.1uF, 16V  [C0402_100X050H050_H]  (hidden comment: Capacitor)
C26  Schematic Value: 0.1uF, 16V  [C0402_100X050H050_H]  (hidden comment: Capacitor)
C27  Schematic Value: 0.1uF, 16V  [C0402_100X050H050_H]  (hidden comment: Capacitor)
C28  Schematic Value: 0.1uF, 16V  [C0402_100X050H050_H]  (hidden comment: Capacitor)
C29  Schematic Value: 0.1uF, 16V  [C0402_100X050H050_H]  (hidden comment: Capacitor)
C30  Schematic Value: 0.1uF, 16V  [C0402_100X050H050_H]  (hidden comment: Capacitor)
C31  Schematic Value: 0.1uF, 16V  [C0402_100X050H050_H]  (hidden comment: Capacitor)
C32  Schematic Value: 4.7uF, 10V  [C0402_100X050H050_H]  (hidden comment: Capacitor)
C33  Schematic Value: 4.7uF, 10V  [C0402_100X050H050_H]  (hidden comment: Capacitor)
C34  Schematic Value: 0.1uF, 16V  [C0402_100X050H050_H]  (hidden comment: Capacitor)
C35  Schematic Value: 4.7uF, 10V  [C0402_100X050H050_H]  (hidden comment: Capacitor)
C36  Schematic Value: 4.7uF, 10V  [C0402_100X050H050_H]  (hidden comment: Capacitor)
C37  Schematic Value: 4.7uF, 10V  [C0402_100X050H050_H]  (hidden comment: Capacitor)
DA1  Schematic Value: LMV321IDBVR  [SOT-23-5_095P290X160X145_N]  (hidden comment: OPA-1-5p_2)
DA2  Schematic Value: LMV321IDBVR  [SOT-23-5_095P290X160X145_N]  (hidden comment: OPA-1-5p_2)
DA3  Schematic Value: TLV75533PDBVR  [SOT-23-5_095P290X160X145_N]  (hidden comment: TLV755xxPDBV-Series)
DD1  Schematic Value: LPC4322JET100  [TFBGA-100_080P900X900X120_N]  (hidden comment: LPC43xxJET100-Series)  (part C of 3)
KT3  Text  [TP-SMT-C-1mm]  (value not drawn)  (no BOM)
KT4  Text  [TP-SMT-C-1mm]  (value not drawn)  (no BOM)
KT5  Text  [TP-SMT-R-1.0mm]  (value not drawn)  (no BOM)
KT6  Text  [TP-SMT-R-1.0mm]  (value not drawn)  (no BOM)
L1  Schematic Value: 1000ohm, 250mA  [L0402_100X050H050_H]  (hidden comment: FerriteBead)
R47  Schematic Value: 5.1k ±1%  [R0402_100X050H035_H]  (hidden comment: Resistor)
R48  Resistor  [R0402_100X050H035_H]  (value not drawn)
R49  Schematic Value: 1 ±1%  [R0402_100X050H035_H]  (hidden comment: Resistor)
R50  Schematic Value: 5.1k ±1%  [R0402_100X050H035_H]  (hidden comment: Resistor)
R51  Resistor  [R0402_100X050H035_H]  (value not drawn)
R52  Resistor  [R0402_100X050H035_H]  (value not drawn)
R53  Schematic Value: 10k ±1%  [R0402_100X050H035_H]  (hidden comment: Resistor)
R54  Resistor  [R0402_100X050H035_H]  (value not drawn)
R55  Schematic Value: 10k ±1%  [R0402_100X050H035_H]  (hidden comment: Resistor)
R56  Schematic Value: 10k ±1%  [R0402_100X050H035_H]  (hidden comment: Resistor)
R57  Resistor  [R0402_100X050H035_H]  (value not drawn)  (no BOM)
R58  Resistor  [R0402_100X050H035_H]  (value not drawn)
R59  Schematic Value: 10k ±1%  [R0402_100X050H035_H]  (hidden comment: Resistor)
R60  Schematic Value: 10k ±1%  [R0402_100X050H035_H]  (hidden comment: Resistor)
R61  Resistor  [R0402_100X050H035_H]  (value not drawn)
R62  Schematic Value: 10k ±1%  [R0402_100X050H035_H]  (hidden comment: Resistor)
R63  Schematic Value: 10k ±1%  [R0402_100X050H035_H]  (hidden comment: Resistor)
R64  Schematic Value: 10k ±1%  [R0402_100X050H035_H]  (hidden comment: Resistor)
R65  Schematic Value: 10k ±1%  [R0402_100X050H035_H]  (hidden comment: Resistor)
R66  Schematic Value: 10k ±1%  [R0402_100X050H035_H]  (hidden comment: Resistor)
R67  Schematic Value: 10k ±1%  [R0402_100X050H035_H]  (hidden comment: Resistor)
R68  Schematic Value: 100 ±1%  [R0402_100X050H035_H]  (hidden comment: Resistor)
VD1  Diode  [SOD-523]  (value not drawn)
VD2  Diode  [SOD-523]  (value not drawn)
VD3  Diode  [SOD-523]  (value not drawn)
VT2  MOSFET-PP_8p_2  [SOT-1118-2M_065P200X200X065_N]  (value not drawn)  (parts A,B of 2)
XP3  Text  [PLS-4]  (value not drawn)
XP4  Text  [PLS-4]  (value not drawn)

### Nets
AVCC3P3: C33.2 C34.2 DD1.B2(VDDA) L1.2
GND: C21.1 C22.1 C23.1 C24.1 C25.1 C26.1 C27.1 C28.1 C29.1 C30.1 C31.1 C32.2 C33.1 C34.1 C35.2 C36.2 C37.2 DA1.2(V-) DA2.2(V-) DA3.2(GND) DD1.C2(VSSA) DD1.C8(VSS) DD1.D3(USB0_VSSA) DD1.D4(VSS) DD1.D5(VSS) DD1.F2(USB0_VSSA) DD1.G8(VSS) DD1.J3(VSS) DD1.J6(VSS) KT5.1 KT6.1 R47.1 R57.1 R59.2 R63.2 R64.2 R67.2 XP3.3 XP4.3
ISEN: R48.2 R49.2 R53.2 R56.2 VT2.6(D1)
PTARGET: VT2.3(D2)
VBUS: C23.2 C24.2 C32.1 DA1.5(V+) DA2.5(V+) DA3.1(IN) DA3.3(EN) KT3.1 R48.1 R49.1
VCC3P3: C25.2 C26.2 C27.2 C28.2 C29.2 C30.2 C31.2 C35.1 C36.1 C37.1 DA3.5(OUT) DD1.C5(VBAT) DD1.D1(USB0_VDDAD) DD1.D2(USB0_VDDA) DD1.E4(VDDREG) DD1.E5(VDDREG) DD1.F4(VDDREG) DD1.F10(VDDIO) DD1.K5(VDDIO) KT4.1 L1.1 R51.2 R52.2 R54.2 R58.2 R60.1 R61.2 R62.2
VSEN: R55.1
VSEN_ADC: DA2.4(OUT) R66.2
VTARGET: C22.2 R68.2
MCU_RST: DD1.B6(~{RESET}) R62.1 XP3.4
MCU_TCK: DD1.H2(TCK) R58.1 XP3.2
MCU_TDI: DD1.G3(TDI) R52.1
MCU_TDO: DD1.H3(TDO) R51.1
MCU_TMS: DD1.C4(TMS) R54.1 XP3.1
MCU_TRST: DD1.B4(~{TRST}) R61.1
P2_3: XP4.2
P2_4: XP4.1
P2_7: XP4.4
P2_8: R47.2 R50.2
P3_1: VD1.2(К) VD2.2(К)
NetC21_2: C21.2 DA1.1(IN+) R50.1 R57.2
NetDA1_3: DA1.3(IN-) R63.1 R65.1
NetDA1_4: DA1.4(OUT) VD3.1(А)
NetDA2_1: DA2.1(IN+) R55.2 R59.1
NetDA2_3: DA2.3(IN-) R64.1 R66.1
NetDD1_A6: DD1.A6(DBGEN) R60.2
NetR53_1: R53.1 VD2.1(А) VT2.5(G2)
NetR56_1: R56.1 VD1.1(А) VT2.2(G1)
NetR65_2: R65.2 R67.1 R68.1 VD3.2(К)
NetVT2_1: VT2.1(S1) VT2.4(S2)

Not connected (* = marked no-connect by the designer): DA3 4(NC); DD1 A4(WAKEUP0)* C3(RTC_ALARM)*

### Notes on the sheet
- (near R57) DNI
- Подп. и дата
- Инв. № дубл.
- Взам. инв. №
- Инв. № подл.
- Изм.
- Лист
- № докум.
- Подп.
- Дата
- Форма 2а ГОСТ 2.104-2006
- Копировал
- Формат А2
- (in symbol LPC4322JET100, part C) MCU
- (in symbol TLV75533PDBVR) *STU

### Library data of the parts
C21 C23-C31 C34 = GCM155R71C104KA55D: as C5 on sheet 01_USB; Part Number: GCM155R71C104KA55D; Footprint: 0402; LCSC Part: C85857; Temperature Min: -55°С; Temperature Max: +125°С; Part Type: Конденсатор
C22 C32 C33 C35-C37 = GRM155R61A475MEAAD: Manufacturer: Murata; ID: 255; Value: 4.7uF; Voltage: 10V; Tolerance: ±20%; Dielectric Type: X5R; Functional Analog: GRM155R61A475MEAAJ; AEC Standard: General; Part Number: GRM155R61A475MEAAD; Footprint: 0402; LCSC Part: C335105; Temperature Min: -55°С; Temperature Max: +85°С; Part Type: Конденсатор
  C32 C35-C37: ClassName: DC
DA1 DA2 = LMV321IDBVR: Manufacturer: Texas Instruments; ID: 46; Supply Operation: +2.7…5.5V; Supply Current: 130uA; Rail-to-Rail: +\+; Slew Rate: 1V/µs; Bandwidth: 1MHz; Published: 11.04.2014; Publisher: Andrew Danich; Type: Микросхема; Part Number: LMV321IDBVR; Value: LMV321IDBVR; Temperature Min: -40°С; Temperature Max: +125°С; LCSC Part: C7972; Part Type: Микросхема
DA3 = TLV75533PDBVR: Manufacturer: Texas Instruments; ID: 37; Value: TPS73101DBVR; Input Voltage: +1.45…5.5V; Output Current: 0.5A; Output Voltage: +3.3V; Functional Analog: TLV75533PDBVT; Published: 23.05.2020; Publisher: Andrew Danich; Type: Микросхема; Part Number: TLV75533PDBVR; LCSC Part: C404027; Temperature Min: -40°С; Temperature Max: +125°С; Part Type: Микросхема; ClassName: DC
DD1 = LPC4322JET100: as DD1 on sheet 01_USB; Part Number: LPC4322JET100; Value: LPC4322JET100; Temperature Min: -40°С; Temperature Max: +105°С
KT3 KT4 = TestPoint-SMT: as KT1 on sheet 02_MCU_IO; Published: 03.03.2015; Publisher: Andrew Danich; Part Number: TestPoint-SMT; Value: TestPoint-SMT; Schematic Value: TestPoint-SMT
KT5 KT6 = TestPoint-SMT-GND: ID: 7; Application Type: On PCB Test Point; Published: 03.03.2015; Publisher: Andrew Danich; Part Number: TestPoint-SMT-GND; Value: TestPoint-SMT; Schematic Value: TestPoint-SMT-GND
L1 = BLM15HD102SN1D: Manufacturer: Murata; ID: 7; Rated Current: 250mA; Impedance: 1000ohm; Tolerance: ±25%; DC Resistance: 1.25ohm; Inductor Type: EMIFIL; Application Category: 1; Functional Analog: BLM15HD102SN1B; Part Number: BLM15HD102SN1D; Value: BLM15HD102SN1D; Footprint: 0402; Temperature Min: -55°С; Temperature Max: +125°С; Part Type: Ферритовая бусина
R47 R50 = 0402WGF5101TCE: as R2 on sheet 01_USB; Part Number: 0402WGF5101TCE; Footprint: 0402; Temperature Min: -55°С; Temperature Max: +155°С; Part Type: Резистор; LCSC Part: C25905
R48 = RC0402FR-071RL: Manufacturer: Yageo; ID: 658; Value: 1; Limit Voltage: 50V; Tolerance: ±1%; Temperature Coefficient: 100ppm; Total Power Dissipation: 0.1W; Series Type: Thick-Film; Schematic Value: 1 ±1%; Part Number: RC0402FR-071RL; Footprint: 0402; Temperature Min: -55°С; Temperature Max: +155°С; Part Type: Резистор
R49 = RC0402FR-071RL: Manufacturer: Yageo; ID: 658; Value: 1; Limit Voltage: 50V; Tolerance: ±1%; Temperature Coefficient: 100ppm; Total Power Dissipation: 0.1W; Series Type: Thick-Film; Part Number: RC0402FR-071RL; Footprint: 0402; Temperature Min: -55°С; Temperature Max: +155°С; Part Type: Резистор
R51 R52 R54 R58 R61 = 0402WGF1002TCE: as R13 on sheet 01_USB; Part Number: 0402WGF1002TCE; Footprint: 0402; Temperature Min: -55°С; Temperature Max: +155°С; Part Type: Резистор; LCSC Part: C25744
R53 R55 R56 R59 R60 R62-R67 = 0402WGF1002TCE: as R7 on sheet 01_USB; Part Number: 0402WGF1002TCE; Footprint: 0402; Temperature Min: -55°С; Temperature Max: +155°С; Part Type: Резистор; LCSC Part: C25744
R57 = 0402WGF5101TCE: Manufacturer: Uniroyal Elec; ID: 667; Value: 5.1k; Limit Voltage: 50V; Tolerance: ±1%; Temperature Coefficient: 100ppm; Total Power Dissipation: 0.1W; Series Type: Thick-Film; Schematic Value: 5.1k ±1%; Part Number: 0402WGF5101TCE; Footprint: 0402; Temperature Min: -55°С; Temperature Max: +155°С; Part Type: Резистор; LCSC Part: C25905
R68 = RC0402FR-07100RL: as R5 on sheet 01_USB; Part Number: RC0402FR-07100RL; Footprint: 0402; Temperature Min: -55°С; Temperature Max: +155°С; Part Type: Резистор
VD1-VD3 = 1N4148WT-7: Manufacturer: Diodes Incorporated; ID: 18; Reverse Voltage: 100V; Reverse Current: 1uA; Forward Voltage: 1.25V; Forward Current: 250mA; Total Power Dissipation: 200mW; Capacitance: 2pF; Recovery Time: 4nS; Functional Analog: 1N4148X-TP; Part Number: 1N4148WT-7; Value: 1N4148WT-7; LCSC Part: C83482; Temperature Min: -65°С; Temperature Max: +150°С; Schematic Value: 1N4148WT-7
VT2 = PMDPB55XP,115: Manufacturer: NXP Semiconductors; Type: Сборка транзисторная; ID: 22; D-S Voltage: -20V; Drain Current: -4.5A; D-S On-Resistance: 70momh; Gate Capacitance: 785pF; Total Power Dissipation: 1.17W; Gate Threshold Voltage: -0.9V; Published: 18.07.2014; Publisher: Andrew Danich; Schematic Value: PMDPB55XP,115; Part Number: PMDPB55XP,115; Value: PMDPB55XP,115; LCSC Part: C552752; Temperature Min: -55°С; Temperature Max: +150°С; Part Type: Транзисторная сборка
XP3 XP4 = PLS-4: ID: 3; Value: PLS-4; Limit Voltage: 250V; Limit Current: 3A; Connector Type: Male; Resistance: 15momh; Surface Finish: Gold; Pitch: 2.54mm; Part Number: PLS-4; Pins: 4; Schematic Value: PLS-4

## Nets that join several sheets
GND: 01_USB (24 pins), 02_MCU_IO (37 pins), 03_POWER (39 pins)
ISEN: 01_USB (R14.1), 03_POWER (5 pins)
PTARGET: 01_USB (R16.1), 02_MCU_IO (XP2.1), 03_POWER (VT2.3)
VBUS: 01_USB (5 pins), 03_POWER (10 pins)
VCC3P3: 01_USB (R8.1 R10.1), 02_MCU_IO (16 pins), 03_POWER (28 pins)
VSEN: 02_MCU_IO (XP1.1 XP2.2 XS2.1), 03_POWER (R55.1)
VSEN_ADC: 01_USB (R15.1), 03_POWER (DA2.4 R66.2)
VTARGET: 02_MCU_IO (14 pins), 03_POWER (C22.2 R68.2)
P2_3: 02_MCU_IO (DD1.D8 R22.1), 03_POWER (XP4.2)
P2_4: 02_MCU_IO (DD1.D9 R20.1), 03_POWER (XP4.1)
P2_7: 02_MCU_IO (DD1.C10 R21.2), 03_POWER (XP4.4)
P2_8: 02_MCU_IO (DD1.C6), 03_POWER (R47.2 R50.2)
P3_1: 02_MCU_IO (DD1.F7), 03_POWER (VD1.2 VD2.2)